# EAGLE design 140508_AriloTX_REV2_0_0 (EAGLE 6.4)
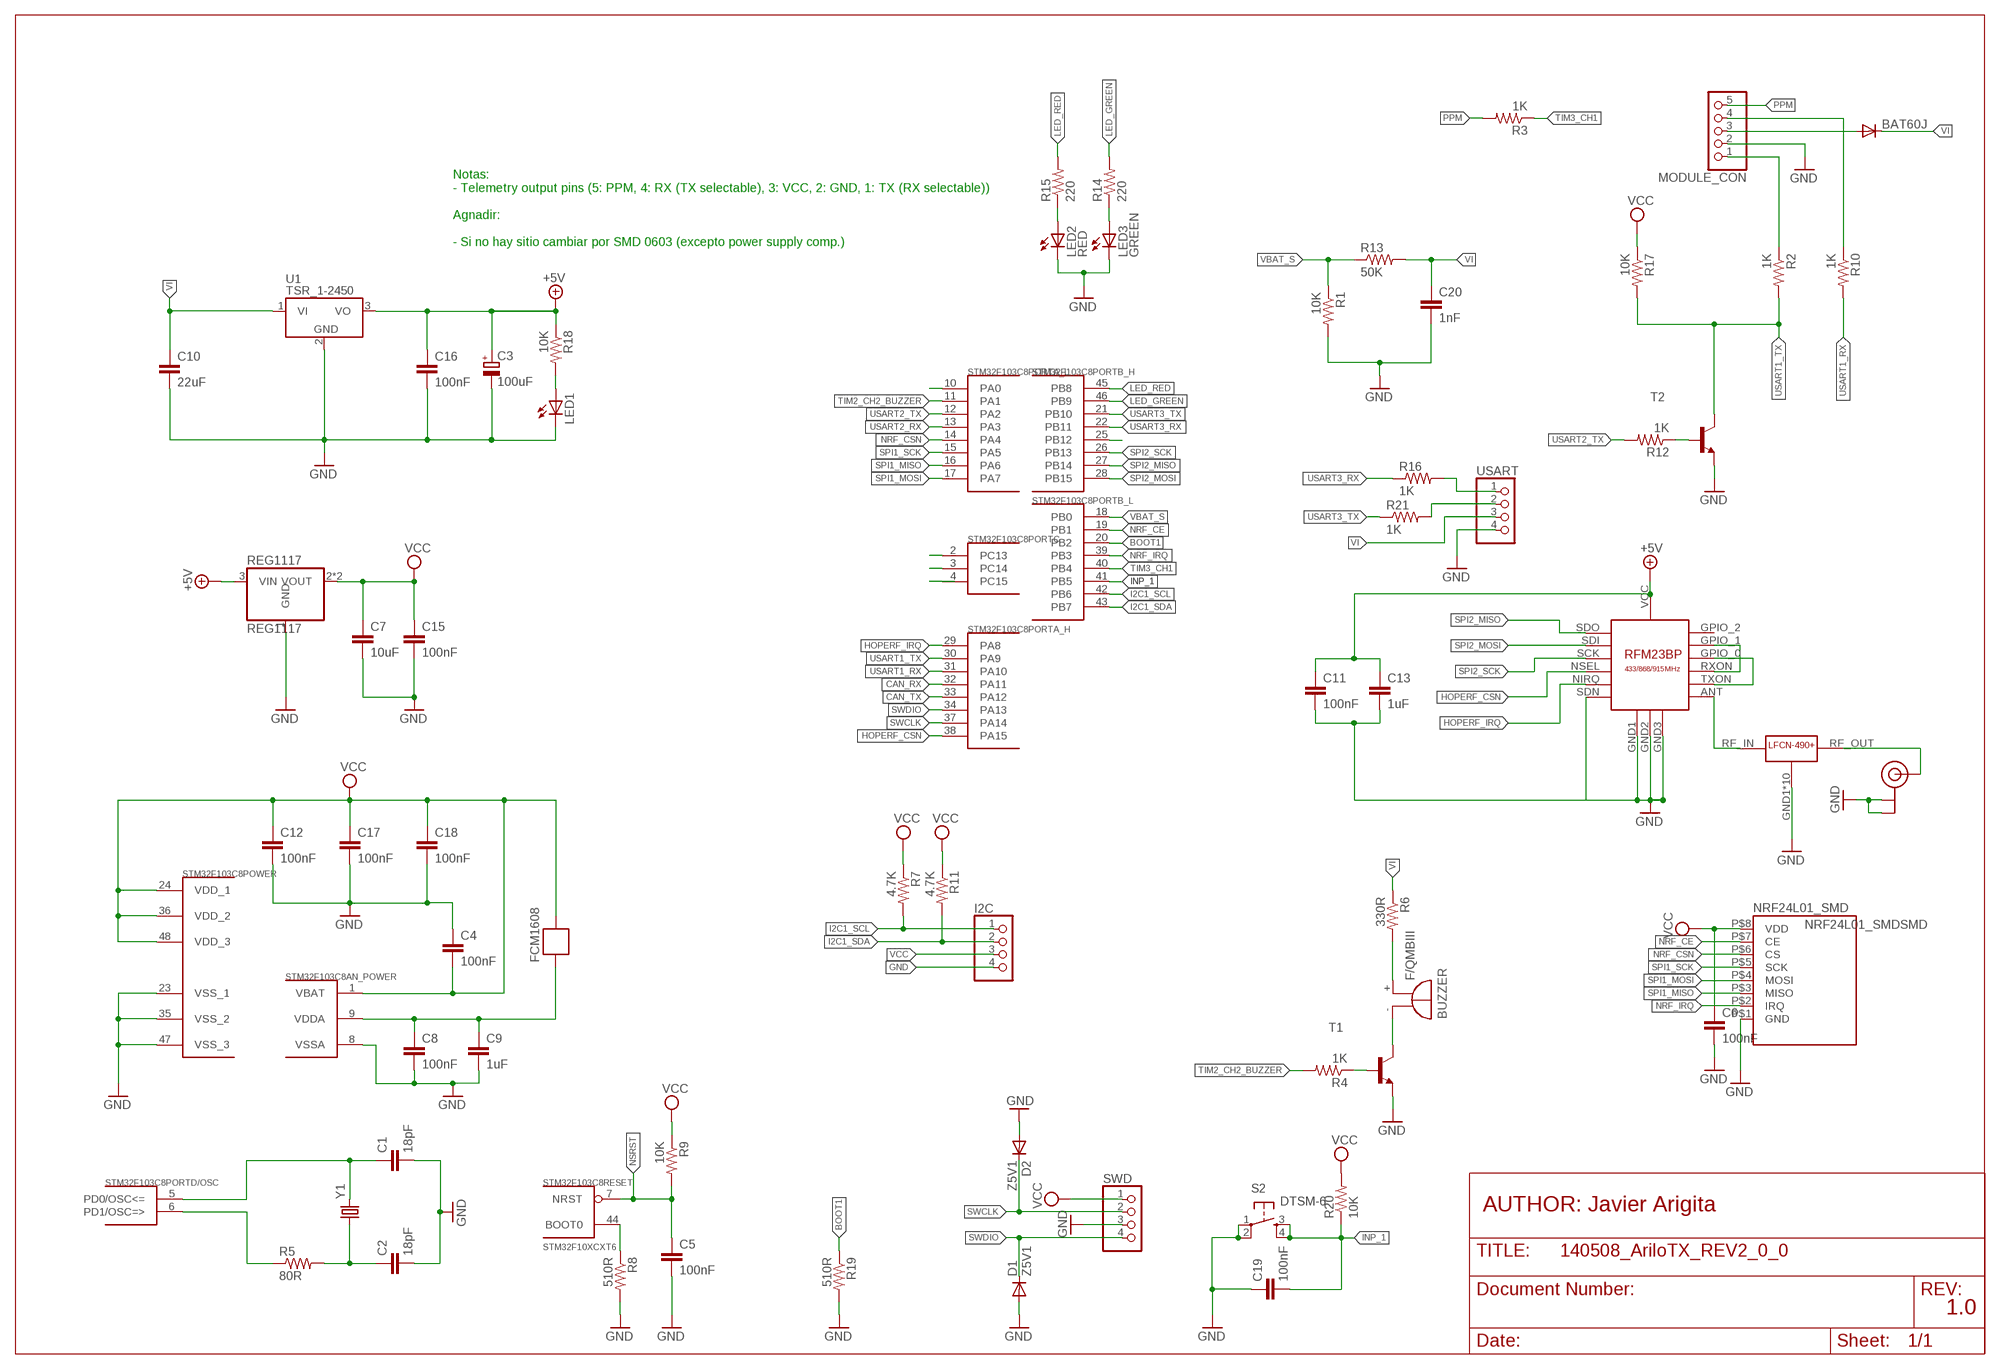
[diagram p0: schematic, sheet 1]

## Parts
BAT60J  DIODE-SOD323-R  [SOD323-R]
BUZZER  F/QMBIII  [F/QMBIII]
C1  18pF  C-EUC0805  [C0805]
C2  18pF  C-EUC0805  [C0805]
C3  100uF  CPOL-EUSMCB  [SMC_B]
C4  100nF  C-EUC0805  [C0805]
C5  100nF  C-EUC0805  [C0805]
C6  100nF  C-EUC0805  [C0805]
C7  10uF  C-EUC0805  [C0805]
C8  100nF  C-EUC0805  [C0805]
C9  1uF  C-EUC3216  [C3216]
C10  22uF  C-EUC3216  [C3216]
C11  100nF  C-EUC0805  [C0805]
C12  100nF  C-EUC0805  [C0805]
C13  1uF  C-EUC3216  [C3216]
C15  100nF  C-EUC0805  [C0805]
C16  100nF  C-EUC0805  [C0805]
C17  100nF  C-EUC0805  [C0805]
C18  100nF  C-EUC0805  [C0805]
C19  100nF  C-EUC0805  [C0805]
C20  1nF  C-EUC0805  [C0805]
D1  Z5V1  DIODE-SOD323-R  [SOD323-R]
D2  Z5V1  DIODE-SOD323-R  [SOD323-R]
FCM1608  FERRITE-BEAD  [R0603]
I2C  PINHD-1X4  [1X04]
LED1  LED0805  [CHIPLED_0805]
LED2  RED  LEDCHIP-LED0805  [CHIP-LED0805]
LED3  GREEN  LEDCHIP-LED0805  [CHIP-LED0805]
MODULE_CON  PINHD-1X5  [1X05]
NRF24L01_SMD  NRF24L01_SMDSMD  [NRF24L01_SMD]
R1  10K  RESISTOR0805  [R0805]
R2  1K  RESISTOR0805  [R0805]
R3  1K  RESISTOR0805  [R0805]
R4  1K  RESISTOR0805  [R0805]
R5  80R  RESISTOR0805  [R0805]
R6  330R  RESISTOR0805  [R0805]
R7  4.7K  RESISTOR0805  [R0805]
R8  510R  RESISTOR0805  [R0805]
R9  10K  RESISTOR0805  [R0805]
R10  1K  RESISTOR0805  [R0805]
R11  4.7K  RESISTOR0805  [R0805]
R12  1K  RESISTOR0805  [R0805]
R13  50K  RESISTOR0805  [R0805]
R14  220  RESISTOR0805  [R0805]
R15  220  RESISTOR0805  [R0805]
R16  1K  RESISTOR0805  [R0805]
R17  10K  RESISTOR0805  [R0805]
R18  10K  RESISTOR0805  [R0805]
R19  510R  RESISTOR0805  [R0805]
R20  10K  RESISTOR0805  [R0805]
R21  1K  RESISTOR0805  [R0805]
REG1117  REG1117  [SOT223]
S2  DTSM-6  [DTSM-6]
STM32F103C8  STM32F10XCXT6  [TQFP48]
SWD  PINHD-1X4  [1X04]
T1  BC848-NPN-SOT23-BEC  [SOT23-BEC]
T2  BC848-NPN-SOT23-BEC  [SOT23-BEC]
U1  TSR_1-2450  [TSR-1]
U$1  RFM23BP  [RFM23BP]
U$2  LFCN490+  [LFCN490+]
U$3  U.FL  [U.FL]
USART  PINHD-1X4  [1X04]
Y1  CRYSTAL5X3  [CRYSTAL-SMD-5X3]

## Nets
+5V: C3.+ C11.1 C13.1 C16.1 R18.1 REG1117.3(VIN) U1.3(VO) U$1.VCC
BOOT1: R19.1 STM32F103C8.20(PORTB_L:PB2)
CAN_RX: STM32F103C8.32(PORTA_H:PA11)
CAN_TX: STM32F103C8.33(PORTA_H:PA12)
GND: C1.2 C2.2 C3.- C4.1 C5.2 C6.2 C7.2 C8.2 C9.2 C10.2 C11.2 C12.2 C13.2 C15.2 C16.2 C17.2 C18.2 C19.1 C20.2 D1.A D2.A I2C.4 LED1.C LED2.C LED3.C MODULE_CON.2 NRF24L01_SMD.P$1(GND) R1.2 R8.2 R19.2 REG1117.1(GND) S2.1 S2.2 STM32F103C8.8(AN_POWER:VSSA) STM32F103C8.23(POWER:VSS_1) STM32F103C8.35(POWER:VSS_2) STM32F103C8.47(POWER:VSS_3) SWD.3 T1.E T2.E U1.2(GND) U$1.GND1 U$1.GND2 U$1.GND3 U$1.SDN U$2.GND1(GND) U$2.GND2(GND) U$2.GND3(GND) U$2.GND4(GND) U$2.GND5(GND) U$2.GND6(GND) U$2.GND7(GND) U$2.GND8(GND) U$2.GND9(GND) U$2.GND10(GND) U$3.P$1(GND) U$3.P$2(GND) USART.4
HOPERF_CSN: STM32F103C8.38(PORTA_H:PA15) U$1.NSEL
HOPERF_IRQ: STM32F103C8.29(PORTA_H:PA8) U$1.NIRQ
I2C1_SCL: I2C.1 R7.2 STM32F103C8.42(PORTB_L:PB6)
I2C1_SDA: I2C.2 R11.2 STM32F103C8.43(PORTB_L:PB7)
INP_1: C19.2 R20.1 S2.3 S2.4 STM32F103C8.41(PORTB_L:PB5)
LED_GREEN: R14.2 STM32F103C8.46(PORTB_H:PB9)
LED_RED: R15.2 STM32F103C8.45(PORTB_H:PB8)
N$1: C1.1 STM32F103C8.5(PORTD/OSC:PD0/OSC<=) Y1.3
N$2: R5.1 STM32F103C8.6(PORTD/OSC:PD1/OSC=>)
N$3: C2.1 R5.2 Y1.1
N$4: R8.1 STM32F103C8.44(RESET:BOOT0)
N$5: R12.1 T2.B
N$6: MODULE_CON.1 R2.1
N$7: LED2.A R15.1
N$8: LED3.A R14.1
N$9: MODULE_CON.4 R10.1
N$10: LED1.A R18.2
N$11: U$1.ANT U$2.RF_IN(RF_INP)
N$12: R16.2 USART.1
N$13: R21.2 USART.2
N$14: BAT60J.A MODULE_CON.3
N$15: STM32F103C8.2(PORTC:PC13)
N$16: BUZZER.+(-) R6.2
N$17: C8.1 C9.1 FCM1608.2 STM32F103C8.9(AN_POWER:VDDA)
N$18: STM32F103C8.3(PORTC:PC14)
N$20: U$2.RF_OUT(RF_OUTP) U$3.P$3(SIGNAL)
N$21: R4.1 T1.B
N$22: STM32F103C8.25(PORTB_H:PB12)
N$23: BUZZER.-(+) T1.C
N$24: STM32F103C8.10(PORTA_L:PA0)
N$25: U$1.GPIO_1 U$1.RXON
N$26: U$1.GPIO_0 U$1.TXON
NRF_CE: NRF24L01_SMD.P$7(CE) STM32F103C8.19(PORTB_L:PB1)
NRF_CSN: NRF24L01_SMD.P$6(CS) STM32F103C8.14(PORTA_L:PA4)
NRF_IRQ: NRF24L01_SMD.P$2(IRQ) STM32F103C8.39(PORTB_L:PB3)
NSRST: C5.1 R9.2 STM32F103C8.7(RESET:NRST)
PPM: MODULE_CON.5 R3.2
SPI1_MISO: NRF24L01_SMD.P$3(MISO) STM32F103C8.16(PORTA_L:PA6)
SPI1_MOSI: NRF24L01_SMD.P$4(MOSI) STM32F103C8.17(PORTA_L:PA7)
SPI1_SCK: NRF24L01_SMD.P$5(SCK) STM32F103C8.15(PORTA_L:PA5)
SPI2_MISO: STM32F103C8.27(PORTB_H:PB14) U$1.SDO
SPI2_MOSI: STM32F103C8.28(PORTB_H:PB15) U$1.SDI
SPI2_SCK: STM32F103C8.26(PORTB_H:PB13) U$1.SCK
SWCLK: D2.C STM32F103C8.37(PORTA_H:PA14) SWD.2
SWDIO: D1.C STM32F103C8.34(PORTA_H:PA13) SWD.4
TIM2_CH2_BUZZER: R4.2 STM32F103C8.11(PORTA_L:PA1)
TIM3_CH1: R3.1 STM32F103C8.40(PORTB_L:PB4)
USART1_RX: R10.2 STM32F103C8.31(PORTA_H:PA10)
USART1_TX: R2.2 R17.2 STM32F103C8.30(PORTA_H:PA9) T2.C
USART2_RX: STM32F103C8.13(PORTA_L:PA3)
USART2_TX: R12.2 STM32F103C8.12(PORTA_L:PA2)
USART3_RX: R16.1 STM32F103C8.22(PORTB_H:PB11)
USART3_TX: R21.1 STM32F103C8.21(PORTB_H:PB10)
VBAT_S: R1.1 R13.1 STM32F103C8.18(PORTB_L:PB0)
VCC: C4.2 C6.1 C7.1 C12.1 C15.1 C17.1 C18.1 FCM1608.1 I2C.3 NRF24L01_SMD.P$8(VDD) R7.1 R9.1 R11.1 R17.1 R20.2 REG1117.2(VOUT) REG1117.4(VOUT) STM32F103C8.1(AN_POWER:VBAT) STM32F103C8.24(POWER:VDD_1) STM32F103C8.36(POWER:VDD_2) STM32F103C8.48(POWER:VDD_3) SWD.1
VI: BAT60J.C C10.1 C20.1 R6.1 R13.2 U1.1(VI) USART.3
Unconnected: STM32F103C8.4(PORTC:PC15) U$1.GPIO_2

## Notes on the sheet
- Notas:
  - Telemetry output pins (5: PPM, 4: RX (TX selectable), 3: VCC, 2: GND, 1: TX (RX selectable))
  
  Agnadir:
  
  - Si no hay sitio cambiar por SMD 0603 (excepto power supply comp.)
- AUTHOR: Javier Arigita
- 1.0

## Library data of the parts
BAT60J D1 D2 = diode:DIODE-: DIODE
BUZZER = buzzer:F/QMBIII: BUZZER Source: Buerklin; OC_FARNELL: unknown; OC_NEWARK: unknown
C1 C2 C4-C8 C11 C12 C15-C20 = rcl:C-EU: CAPACITOR, European symbol
C3 = rcl:CPOL-EU: POLARIZED CAPACITOR, European symbol
C9 C10 C13 = resistor:C-EU: CAPACITOR, European symbol
FCM1608 = BaseApp:FERRITE-BEAD
I2C SWD USART = pinhead:PINHD-1X4: PIN HEADER
LED1 = CEDT:LED
LED2 LED3 = led:LED: LED OSRAM: - CHIPLED LG R971, LG N971, LY N971, LG Q971, LY Q971, LO R971, LY R971 LH N974, LH R974 LS Q976, LO Q976, LY Q976 LO Q996 - Hyper CHIPLED LW Q18S LB Q993, LB Q99A, LB R99A - SideLED LS A670, LO A670, LY A670, LG A670, LP A670 LB A673, LV A673, LT A673, LW A673 LH A674 LY A675 LS A676, LA A676, LO A676, LY A676, LW A676 LS A679, LY A679, LG A679 - Hyper Micro SIDELED® LS Y876, LA Y876, LO Y876, LY Y876 LT Y87S - SmartLED LW L88C, LW L88S LB L89C, LB L89S, LG L890 LS L89K, LO L89K, LY L89K LS L896, LA L896, LO L896, LY L896 - TOPLED LS T670, LO T670, LY T670, LG T670, LP T670 LSG T670, LSP T670, LSY T670, LOP T670, LYG T670 LG T671, LOG T671, LSG T671 LB T673, LV T673, LT T673, LW T673 LH T674 LS T676, LA T676, LO T676, LY T676, LB T676, LH T676, LSB T676, LW T676 LB T67C, LV T67C, LT T67C, LS T67K, LO T67K, LY T67K, LW E67C LS E67B, LA E67B, LO E67B, LY E67B, LB E67C, LV E67C, LT E67C LW T67C LS T679, LY T679, LG T679 LS T770, LO T770, LY T770, LG T770, LP T770 LB T773, LV T773, LT T773, LW T773 LH T774 LS E675, LA E675, LY E675, LS T675 LS T776, LA T776, LO T776, LY T776, LB T776 LHGB T686 LT T68C, LB T68C - Hyper Mini TOPLED® LB M676 - Mini TOPLED Santana® LG M470 LS M47K, LO M47K, LY M47K Source: http://www.osram.convergy.de LUXEON: - LUMILED® LXK2-PW12-R00, LXK2-PW12-S00, LXK2-PW14-U00, LXK2-PW14-V00 LXK2-PM12-R00, LXK2-PM12-S00, LXK2-PM14-U00 LXK2-PE12-Q00, LXK2-PE12-R00, LXK2-PE12-S00, LXK2-PE14-T00, LXK2-PE14-U00 LXK2-PB12-K00, LXK2-PB12-L00, LXK2-PB12-M00, LXK2-PB14-N00, LXK2-PB14-P00, LXK2-PB14-Q00 LXK2-PR12-L00, LXK2-PR12-M00, LXK2-PR14-Q00, LXK2-PR14-R00 LXK2-PD12-Q00, LXK2-PD12-R00, LXK2-PD12-S00 LXK2-PH12-R00, LXK2-PH12-S00 LXK2-PL12-P00, LXK2-PL12-Q00, LXK2-PL12-R00 Source: www.luxeon.com KINGBRIGHT: KA-3528ASYC Source: www.kingbright.com
MODULE_CON = pinhead:PINHD-1X5: PIN HEADER
NRF24L01_SMD = NRF24L01+:NRF24L01_SMD
R1-R21 = CEDT:RESISTOR
REG1117 = CEDT:REG1117: 800mA and 1A Low Dropout (LDO) Positive Regulator 1.8V, 2.5V, 2.85V, 3.3V, 5V, and Adj
S2 = switch-tact:DTSM-6
STM32F103C8 = stm32:STM32F10XCXT6: ST STM32F101/103 48pin LQFP
T1 T2 = transistor:*-NPN-: NPN Transistror BF959 corrected 2008.03.06
U1 = _hhn_traco_tsr-1:TSR_1-*: TRACO TSR-1 Series Point-of-Load DC/DC-Converters Vi max. 36 V; Vo = (1.2 .. 15)V ±2%; Io = 0 .. 1 A SIP-Package (drop-in replacement for 78xx linear voltage regulators in TO220-package, vertically assembled) Source: www.tracopower.com Technologies: TSR 1- Vi (V) Vo (V) ±2% Io = 0 .. 1 A 24_ ( generic ) 2412 4.6 .. 36 1.2 2415 4.6 .. 36 1.5 2418 4.6 .. 36 1.8 2425 4.6 .. 36 2.5 2433 4.75.. 36 3.3 2450 6.5 .. 36 5.0 2465 9.0 .. 36 6.5 2490 12 .. 36 9.0 24120 15 .. 36 12 24150 18 .. 36 15 Author: Dipl.-Ing. FH Rainer Bayer HHN Hochschule Heilbronn, rainer.bayer@hs-heilbronn.de Ingenieurbüro ing-rb, mail@ing-rb.de
U$1 = RFM23BP:RFM23BP: HopeRF RFM23BP Library by: http://projects.weber-itam.de
U$2 = RFM23BP:LFCN490+
U$3 = SparkFun-Connectors:U.FL: SMD antenna connector- WRL-09144
Y1 = SparkFun-FreqCtrl:CRYSTAL: Various standard crystals. Proven footprints. Spark Fun Electronics SKU : COM-00534

## Board
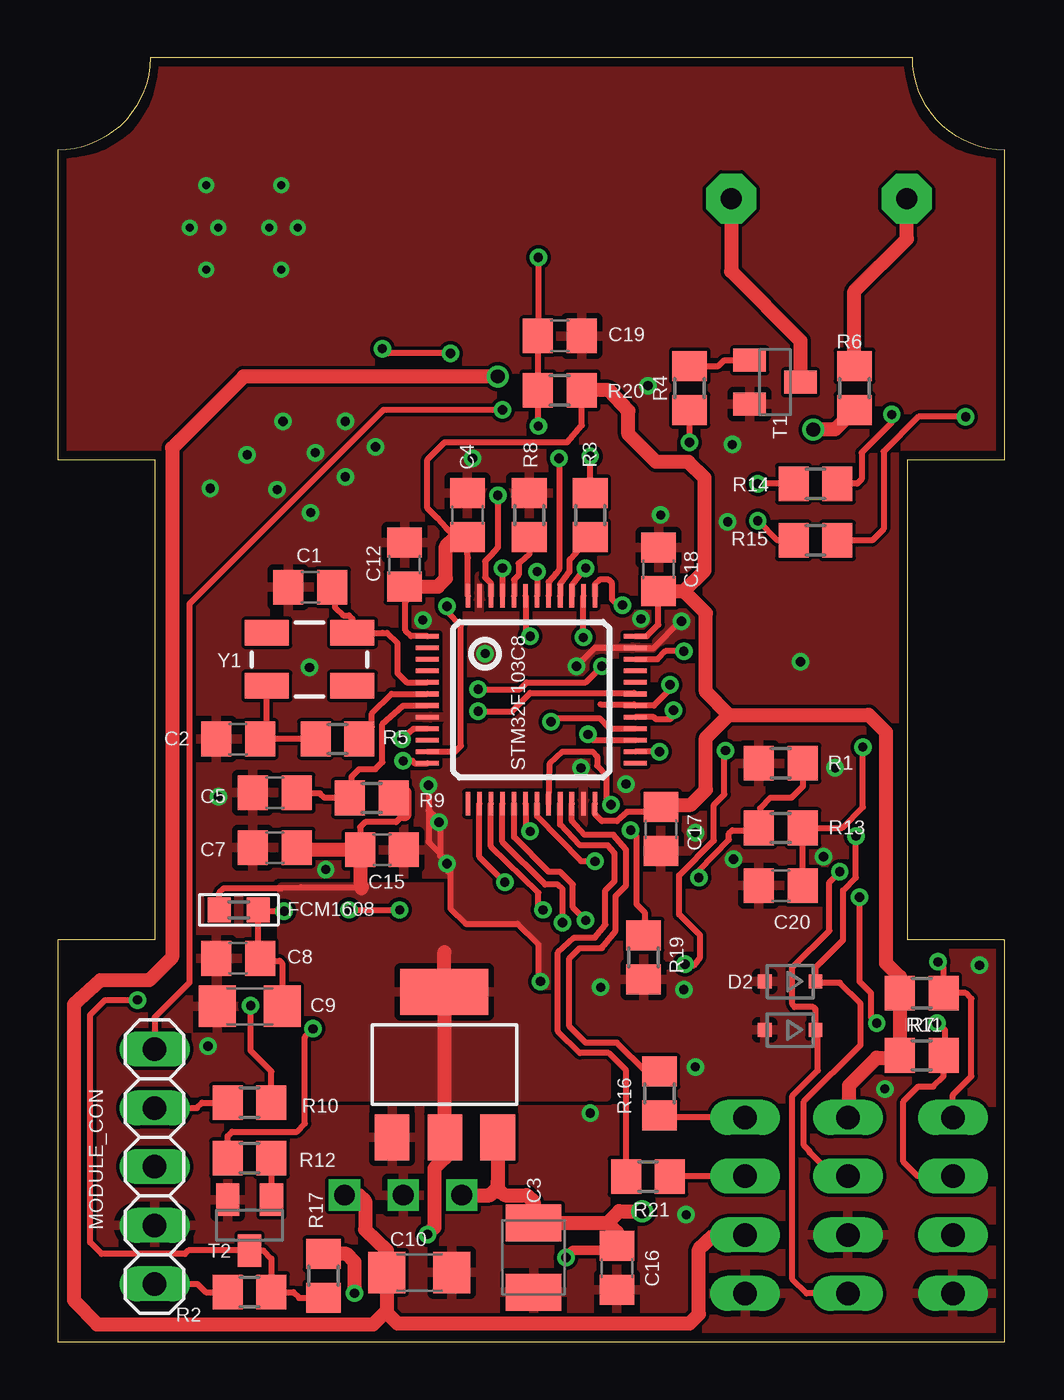
[diagram p1: board, top side]
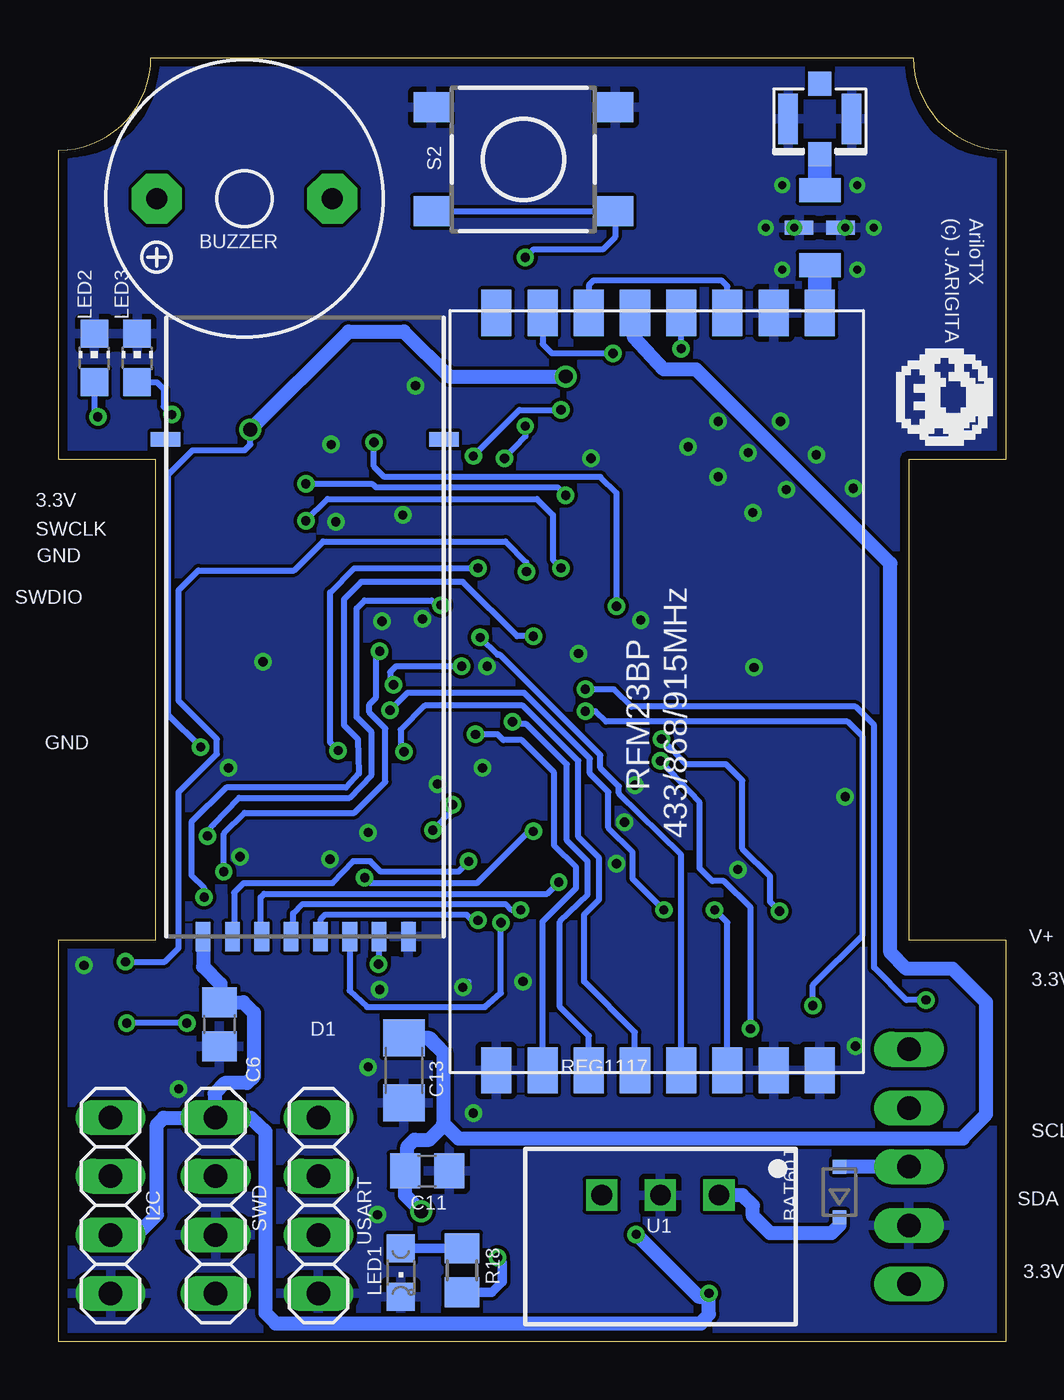
[diagram p2: board, bottom side, seen from below]

Size 41 x 55.6 mm. Coordinates in mm from the lower left corner, seen from the top.
Outline: 0,0 41,0 41,17.4 36.8,17.4 36.8,38.2 41,38.2 41,51.6 arc-90 37,55.6 4,55.6 arc-90 0,51.6 0,38.2 4.2,38.2 4.2,17.4 0,17.4 0,0
Copper layers (1*16): Top 0.0356mm / dielectric 1.5011mm / Bottom 0.0356mm
Design rules "LaenPCBOrder": minimum track width 6mil, minimum drill 13mil, track to track 6mil, track to pad 6mil, pad to pad 6mil, via to via 6mil, smd to smd 6mil, copper to edge 15mil, drill to drill 6mil, minimum pad ring 7mil, minimum via ring 7mil, stop-mask expansion 4mil, vias tented up to drill 0mil, thermal gap 10mil

### Footprints (pad centres in the part's own frame; a part is rotated, then mirrored left to right if it is on the bottom)
SOD323-R = smd 0.6 x 0.6: A 1.1,0; C -1.1,0
F/QMBIII = drill 0.914 pad 2.159 octagon: + 3.8,0; - -3.8,0
C0805 = smd 1.3 x 1.5: 1 -0.95,0; 2 0.95,0
SMC_B = smd 1.6 x 2.4: + -1.5,0; - 1.5,0
C3216 = smd 1.6 x 1.8: 1 -1.4,0; 2 1.4,0
R0603 = smd 1 x 1.1: 1 -0.85,0; 2 0.85,0
1X04 = drill 1.016 long: 1 -3.81,0; 2 -1.27,0; 3 1.27,0; 4 3.81,0
CHIPLED_0805 = smd 1.2 x 1.2: A 0,-1.05; C 0,1.05
CHIP-LED0805 = smd 1.2 x 1.2: A 0,-1.05; C 0,1.05
1X05 = drill 1.016 long: 1 -5.08,0; 2 -2.54,0; 3 0,0; 4 2.54,0; 5 5.08,0
NRF24L01_SMD = smd 1.27 x 0.635: P$1 26.807,10.492; P$2 26.807,9.222; P$3 26.807,7.952; P$4 26.807,6.682; P$5 26.807,5.412; P$6 26.807,4.142; P$7 26.807,2.872; P$8 26.807,1.602 | smd 0.635 x 1.27: P$11 5.267,-0.018; P$13 5.267,12.032
R0805 = smd 1.3 x 1.5: 1 -0.95,0; 2 0.95,0
SOT223 = smd 1.499 x 2.007: 1 -2.261,-3.15; 2 0.025,-3.15; 3 2.311,-3.15 | smd 3.81 x 2.007: 4 0,3.15
DTSM-6 = smd 1.55 x 1.3: 1 -3.975,2.25; 2 3.975,2.25; 3 -3.975,-2.25; 4 3.975,-2.25
TQFP48 = smd 0.2 x 1: 1 -2.75,-4.5; 2 -2.25,-4.5; 3 -1.75,-4.5; 4 -1.25,-4.5; 5 -0.75,-4.5; 6 -0.25,-4.5; 7 0.25,-4.5; 8 0.75,-4.5; 9 1.25,-4.5; 10 1.75,-4.5; 11 2.25,-4.5; 12 2.75,-4.5; 25 2.75,4.5; 26 2.25,4.5; 27 1.75,4.5; 28 1.25,4.5; 29 0.75,4.5; 30 0.25,4.5; 31 -0.25,4.5; 32 -0.75,4.5; 33 -1.25,4.5; 34 -1.75,4.5; 35 -2.25,4.5; 36 -2.75,4.5 | smd 1 x 0.2: 13 4.5,-2.75; 14 4.5,-2.25; 15 4.5,-1.75; 16 4.5,-1.25; 17 4.5,-0.75; 18 4.5,-0.25; 19 4.5,0.25; 20 4.5,0.75; 21 4.5,1.25; 22 4.5,1.75; 23 4.5,2.25; 24 4.5,2.75; 37 -4.5,2.75; 38 -4.5,2.25; 39 -4.5,1.75; 40 -4.5,1.25; 41 -4.5,0.75; 42 -4.5,0.25; 43 -4.5,-0.25; 44 -4.5,-0.75; 45 -4.5,-1.25; 46 -4.5,-1.75; 47 -4.5,-2.25; 48 -4.5,-2.75
SOT23-BEC = smd 1 x 1.4: B -0.95,-1.1; C 0,1.1; E 0.95,-1.1
TSR-1 = drill 0.9 square: 1 -2.54,0; 2 0,0; 3 2.54,0
RFM23BP = smd 2 x 1.3: ANT 16.9,-7.5; GND1 -15.9,6.5; GND2 -15.9,-7.5; GND3 16.9,-5.5; GPIO_0 16.9,2.5; GPIO_1 16.9,4.5; GPIO_2 16.9,6.5; NIRQ -15.9,-3.5; NSEL -15.9,-1.5; RXON 16.9,-1.5; SCK -15.9,0.5; SDI -15.9,2.5; SDN -15.9,-5.5; SDO -15.9,4.5; TXON 16.9,-3.5; VCC 16.9,0.5
LFCN490+ = drill 0.34 pad 0.61: GND1 0.326,2.526; GND2 2.145,3.237; GND3 3.984,2.526; GND4 2.145,2.005; GND7 2.145,-0.205; GND8 0.316,-0.726; GND9 2.145,-1.437; GND10 3.984,-0.726 | smd 0.61 x 1.245: GND5 2.145,1.8; GND6 2.145,0 | smd 1.04 x 1.8: RF_IN 0.52,0.9; RF_OUT 3.77,0.9
U.FL = smd 2.2 x 0.85: P$1 0,1.375; P$2 0,-1.375 | smd 1.05 x 1: P$3 1.525,0; P$4 -1.525,0
CRYSTAL-SMD-5X3 = smd 1.9 x 1.1: 1 -1.85,-1.15; 2 1.85,-1.15; 3 1.85,1.15; 4 -1.85,1.15

### Placement (x,y rotation side)
BAT60J  7.2,6.48 90 bottom
BUZZER  32.95,49.5 180 bottom
C1  10.94,32.67 180 top
C2  7.81,26.1 180 top
C3  20.6,3.65 270 top
C4  17.73,35.8 270 top
C5  9.4,23.77 180 top
C6  34.03,13.75 270 bottom
C7  9.4,21.4 180 top
C8  7.81,16.6 180 top
C9  8.31,14.53 180 top
C10  15.65,3 0 top
C11  25.05,7.4 0 bottom
C12  15.01,33.65 90 top
C13  26.05,11.75 270 bottom
C15  14.04,21.3 0 top
C16  24.2,3.2 270 top
C17  26.11,22.2 270 top
C18  26.01,33.45 90 top
C19  21.73,43.55 180 top
C20  31.3,19.75 180 top
D1  31.7,13.5 180 top
D2  31.7,15.6 180 top
FCM1608  7.83,18.7 0 top
I2C  38.75,5.9 270 bottom
LED1  26.18,3 180 bottom
LED2  39.45,42.6 0 bottom
LED3  37.6,42.6 0 bottom
MODULE_CON  4.19,7.58 90 top
NRF24L01_SMD  36.35,44.35 270 bottom
R1  31.3,25.05 180 top
R2  8.3,2.15 0 top
R3  23.05,35.8 90 top
R4  27.35,41.3 270 top
R5  12.11,26.1 180 top
R6  34.48,41.3 90 top
R7  37.4,15.1 0 top
R8  20.41,35.8 90 top
R9  13.59,23.55 180 top
R10  8.3,10.35 0 top
R11  37.4,12.4 0 top
R12  8.3,7.95 180 top
R13  31.3,22.25 0 top
R14  32.8,37.15 180 top
R15  32.8,34.7 180 top
R16  26.05,10.75 270 top
R17  11.5,2.85 270 top
R18  23.54,3.1 90 bottom
R19  25.36,16.65 270 top
R20  21.73,41.2 0 top
R21  25.55,7.15 0 top
REG1117  16.73,12 0 top
S2  20.89,51.2 0 bottom
STM32F103C8  20.5,27.8 270 top
SWD  34.2,5.9 270 bottom
T1  31.05,41.55 270 top
T2  8.3,5.05 180 top
U1  14.95,6.35 180 bottom
U$1  15.55,27.65 90 bottom
U$2  7.15,46.1 90 bottom
U$3  8.05,52.95 270 bottom
USART  29.75,5.9 270 bottom
Y1  10.9,29.55 0 top

### Tracks (layer width: path | path; a pad name or v marks a point on that pad's centre or on a via)
+5V  (via drill 0.4, 0.6)
  Top 0.406: v22,3.65 22.3,3.95 24,3.95 C16.1
  Top 0.61: U1.3 18.7,6.35 | 18.7,6.35 19.05,6.6 19.35,6.35 20.3,6.35 20.6,6.05 C3.+ 23.8,5.15 | 23.8,5.15 24.2,4.75 C16.1 | REG1117.3 19.05,6.7 19.05,7 19.05,6.65 18.7,6.35 | 23.8,5.15 24.3,5.65 v25.3,5.65
  Bottom 0.406: R18.1 22.25,2.15 21.8,2.6 21.8,3.45 v22,3.65
  Bottom 0.61: v25.3,5.65 26,6.35 C11.1 25.9,7.5 25.9,8.45 25.6,8.75 24.95,8.75 24.35,9.35 24.35,9.45 | 24.35,12.5 24.95,13.15 | 25.85,13.1 25.9,13.15 C13.1 24.95,13.15 | 24.95,13.15 24.95,13.1 24.35,12.5 | 24.35,12.5 24.35,9.45 | 24.35,9.45 23.7,8.8 1.85,8.8 1.85,8.85 0.85,9.85 0.85,14.7 2.3,16.15 4.3,16.15 5,16.85 5,33.7 13.4,42.1 14.8,42.1 16.1,43.5 16.1,44.5 U$1.VCC
BOOT1  (via drill 0.4)
  Top 0.254: STM32F103C8.20 21.3,25.05 21.85,25.55 23.15,25.55 23.35,25.35 23.35,24.95 23.75,24.55 23.75,23.45 v23.95,23.25 | v24.8,22.15 25.05,21.9 25.05,18.95 25.4,18.6 25.4,17.64 R19.1
  Bottom 0.254: v23.95,23.25 23.95,23 v24.8,22.15
GND  (via drill 0.4)
  Top 0.254: 16.9,20.35 16.9,20.7 16.55,21.05 16.55,22.5 16.05,23 v16.05,24.1 16.05,21.65 17,20.7 17,18.75 17.65,18.1 19.9,18.1 20.8,17.2 20.8,15.7 v20.9,15.6 | 26.95,31.2 25.8,30.05 STM32F103C8.35 23.25,30.05 v22.45,29.25
  Bottom 0.254: 23.25,15.6 v23.5,15.35
  other vias: 11.15,38.5 27.6,22.05 27.1,15.25 6.5,12.8 24.6,24.15 23.05,9.9 27.6,11.9 9.75,39.85 6.6,36.95 8.2,38.4 9.5,36.9 10.95,35.9 12.45,37.45 13.75,38.75 12.45,39.85 18.5,29.8 33.15,21 39.9,16.3 27.2,5.5 35.8,10.95 32.15,29.45 29.2,38.85 25.55,41.4 27,31.2 26.1,35.8 6.95,23.6 17.95,38.25 29,35.5 15.8,31.25 29.25,20.9 33.65,24.85 22.65,24.85 16.5,22.5 10.9,29.2 16.85,20.7 11.6,20.45 25.25,31.3
  pour Top (rank 2): 40.5,16.9 36.3,17 36.3,38.7 40.5,38.7 40.5,42.5 40.5,44.5 40.5,51.1 arc-90 36.5,55.1 33.5,55.1 31.5,55.1 9.5,55.1 7.5,55.1 4.5,55.1 arc-90 0.5,51.1 0.5,38.7 4.7,38.7 4.7,16.9 0.5,16.9 0.5,0.5 40.5,0.5
  pour Bottom (rank 2): 40.5,16.9 36.3,17 36.3,38.7 40.5,38.7 40.5,51.1 arc-90 36.5,55.1 4.5,55.1 arc-90 0.5,51.1 0.5,38.7 4.7,38.7 4.7,16.9 0.5,16.9 0.5,0.5 40.5,0.5
HOPERF_CSN  (via drill 0.4)
  Top 0.254: v22.75,30.5 STM32F103C8.38
  Bottom 0.254: U$1.NSEL 14.05,21.1 16.75,23.75 16.75,24.05 17.55,24.85 17.55,25.4 21.9,29.75 22,29.75 v22.75,30.5
HOPERF_IRQ  (via drill 0.4)
  Top 0.254: v12.6,18.7 v14.8,18.7 | v26.65,27.35 26.65,27.1 26.5,26.95 25.9,26.95 25.8,27.05 STM32F103C8.29
  Bottom 0.254: U$1.NIRQ 12.05,18.15 v12.6,18.7 | v14.8,18.7 16.15,20.05 16.15,21.2 17.2,22.25 17.2,23.8 18,24.6 18,25.25 20.85,28.1 25.9,28.1 v26.65,27.35
I2C1_SCL  (via drill 0.4)
  Top 0.254: I2C.1 38.75,10.7 39.55,11.5 39.55,14.85 39.3,15.1 R7.2 38.35,16.2 v38.1,16.45 | v20.75,33.35 STM32F103C8.42
  Bottom 0.254: v38.1,16.45 36.4,16.45 35.8,17.05 35.8,23.8 34.15,25.45 34.15,26.1 35.8,27.75 35.8,32.55 34.95,33.4 30.8,33.4 29.55,34.65 21.65,34.65 20.75,33.75 v20.75,33.35
I2C1_SDA  (via drill 0.4)
  Top 0.254: I2C.2 37.23,7.17 36.6,7.8 36.6,10.4 37.25,11.05 37.9,11.05 38.35,11.5 R11.2 38.4,12.45 38.4,13.5 38.1,13.8 v38.05,13.8 | STM32F103C8.43 20.25,30.75 v20.45,30.55 | v34.7,19.25 34.7,15.6 35.2,15.1 35.2,14.05 v35.45,13.8
  Bottom 0.254: v20.45,30.55 21.15,30.55 23.5,32.9 27.9,32.9 28.65,32.15 28.65,26.7 28.05,26.1 28,24.6 28.55,24 33.75,24 35.25,22.5 35.25,20.2 34.7,19.65 v34.7,19.25 | v35.45,13.8 v38.05,13.8
INP_1  (via drill 0.4)
  Top 0.254: v20.8,46.95 20.8,43.56 C19.2 R20.1 20.79,39.72 v20.8,39.65 | v21.7,38.25 21.7,33.45 21.55,33.25 21.25,32.9 STM32F103C8.41
  Bottom 0.254: S2.3 S2.4 16.91,47.84 17.45,47.3 20.45,47.3 v20.8,46.95 | v20.8,39.65 20.8,39.2 v21.7,38.25
LED_GREEN  (via drill 0.4)
  Top 0.254: R14.2 v30.3,37.15 | v19.05,36.65 19.05,34.4 18.75,34.05 18.5,33.8 18.5,33.1 18.75,32.85 STM32F103C8.46
  Bottom 0.254: v30.3,37.15 27.45,37.15 27.25,37 19.4,37 v19.05,36.65
LED_RED  (via drill 0.4)
  Top 0.254: 31.6,34.7 31.15,34.7 v30.3,35.55 | v19.25,33.5 STM32F103C8.45
  Top 0.61: R15.2 31.6,34.7 31.6,34.75
  Bottom 0.254: v30.3,35.55 29.35,36.5 20.3,36.5 19.6,35.8 19.6,33.85 v19.25,33.5
N$1
  Top 0.254: C1.1 12,32.56 12,31.8 12.35,31.45 12.6,31.45 12.75,31.3 Y1.3 14.05,30.7 14.25,30.7 14.7,30.25 14.7,28.95 14.75,28.9 15.1,28.55 STM32F103C8.5
N$2
  Top 0.254: R5.1 13.6,26.64 13.6,27.2 14.45,28.05 STM32F103C8.6
N$3
  Top 0.254: R5.2 C2.1 9.05,26.39 Y1.1
N$4
  Top 0.254: R8.1 20.41,34.11 20,33.75 19.95,33.7 19.95,33.2 19.75,33 STM32F103C8.44
N$5
  Top 0.254: R12.1 T2.B
  Top 0.406: T2.B 9.1,6.3 9.1,6.35
N$6
  Top 0.254: MODULE_CON.1 6.05,2.5 6.4,2.15 R2.1
N$7  (via drill 0.4)
  Top 0.254: v39.3,40.05 37.25,40.05 35.75,38.55 35.75,35.2 35.25,34.7 R15.1
  Bottom 0.254: LED2.A 39.45,40.2 v39.3,40.05
N$8  (via drill 0.4)
  Top 0.254: v36.1,40.15 36.1,39.8 34.8,38.5 34.8,37.35 34.6,37.15 R14.1
  Bottom 0.254: LED3.A 36.75,41.55 36.45,41.25 36.45,40.5 v36.1,40.15
N$9
  Top 0.254: MODULE_CON.4 6.02,10.12 6.25,10.35 R10.1
N$10
  Bottom 0.406: R18.2 LED1.A
N$11
  Bottom 1.016: U$1.ANT U$2.RF_IN
N$12
  Top 0.254: USART.1 26.14,9.71 R16.2
N$13
  Top 0.254: USART.2 26.52,7.17 R21.2
N$14
  Bottom 0.61: MODULE_CON.3 BAT60J.A
N$16
  Top 0.61: R6.2 34.48,45.48 36.75,47.75 BUZZER.+
N$17  (via drill 0.4)
  Top 0.254: C9.1 9.71,16.39 9.6,16.5 8.86,16.5 C8.1 8.69,16.68 FCM1608.2 8.73,18.65 v9.8,18.65 | v14.9,26.1 15.4,26.55 STM32F103C8.9
  Bottom 0.254: v9.8,18.65 10.2,19.05 10.2,20.15 11.4,21.35 11.4,24.3 12.1,25 13.85,25 14.45,25.65 v14.9,26.1
N$20
  Bottom 1.016: U$3.P$3 U$2.RF_OUT
N$21
  Top 0.254: R4.1 28.6,42.25 28.85,42.5 T1.B
N$23
  Top 0.61: BUZZER.- 29.15,46.35 32.15,43.35 T1.C
N$25  (via drill 0.4)
  Top 0.254: v17,42.8 14.3,42.8 v14.05,43
  Bottom 0.254: U$1.GPIO_1 20.05,43.2 19.65,42.8 v17,42.8 | v14.05,43 U$1.RXON
N$26
  Bottom 0.254: U$1.TXON 12.05,45.7 12.3,45.95 17.85,45.95 18.05,45.75 U$1.GPIO_0
NRF_CE  (via drill 0.4)
  Top 0.254: v23.25,20.8 22.65,20.8 20.75,22.75 STM32F103C8.19
  Bottom 0.254: v23.25,20.8 23.7,20.35 27.05,20.35 27.5,20.8 28.25,20.8 29.15,19.85 33,19.85 33.4,19.45 33.4,17.62 NRF24L01_SMD.P$7
NRF_CSN  (via drill 0.4)
  Top 0.254: v19.35,19.9 18.25,21 STM32F103C8.14
  Bottom 0.254: NRF24L01_SMD.P$6 32.25,17.59 32.25,19.25 32.1,19.4 19.85,19.4 v19.35,19.9
NRF_IRQ  (via drill 0.4)
  Top 0.254: v27.15,16.35 27.2,16.3 27.55,16.3 27.8,16.65 27.8,17.6 26.9,18.5 26.9,20.2 28.4,21.7 28.4,23.25 28.85,23.7 28.85,25.55 v28.9,25.6 | v22.85,33.5 22.7,33.35 22.25,32.75 STM32F103C8.39
  Bottom 0.254: NRF24L01_SMD.P$2 27.15,17.52 v27.15,16.35 | v28.9,25.6 29.25,25.95 29.25,32.45 28.2,33.5 v22.85,33.5
NSRST
  Top 0.254: STM32F103C8.7 14.95,27.55 14.05,26.75 14.05,25.1 13.75,24.8 13.05,24.8 12.71,24.46 12.71,23.62 R9.2 11.55,23.55 11.35,23.75 10.38,23.75 C5.1
PPM  (via drill 0.4)
  Top 0.254: R3.2 v23.05,38.35 | v19.25,40.35 14.1,40.35 5.7,31.95 5.7,15.55 4.19,14.04 MODULE_CON.5
  Bottom 0.254: v23.05,38.35 21.05,40.35 v19.25,40.35
SPI1_MISO  (via drill 0.4)
  Top 0.254: v21.85,18.15 21.85,19.6 21.65,19.8 21.1,19.8 19.25,21.65 STM32F103C8.16
  Bottom 0.254: NRF24L01_SMD.P$3 28.4,15.2 27.65,14.5 22.55,14.5 21.85,15.1 v21.85,18.15
SPI1_MOSI  (via drill 0.4)
  Top 0.254: v22.85,18.25 22.3,18.8 22.3,19.8 21.75,20.35 21.25,20.35 19.75,21.85 STM32F103C8.17
  Bottom 0.254: NRF24L01_SMD.P$4 29.65,17.56 29.65,18.3 29.45,18.5 23.35,18.5 23.1,18.25 v22.85,18.25
SPI1_SCK  (via drill 0.4)
  Top 0.254: v21,18.7 20.8,18.9 20.8,19.45 18.75,21.45 STM32F103C8.15
  Bottom 0.254: NRF24L01_SMD.P$5 30.85,17.63 30.85,18.55 30.45,18.95 21.65,18.95 21.4,18.7 v21,18.7
SPI2_MISO  (via drill 0.4)
  Top 0.254: v22.95,26.3 23.2,26.05 STM32F103C8.27
  Bottom 0.254: U$1.SDO 20.05,18.2 18.6,19.65 18.6,20.55 19.55,21.5 19.55,24.65 20.95,26.05 21.75,26.05 22,26.3 v22.95,26.3
SPI2_MOSI  (via drill 0.4)
  Top 0.254: v21.35,26.85 21.5,27 23.45,27 23.9,26.55 STM32F103C8.28
  Bottom 0.254: U$1.SDI 18.05,13.25 19.3,14.5 19.3,18.2 18.1,19.35 18.1,20.8 19,21.7 19,25 20.75,26.75 21.25,26.75 v21.35,26.85
SPI2_SCK  (via drill 0.4)
  Top 0.254: v26.05,25.55 STM32F103C8.26
  Bottom 0.254: U$1.SCK 16.05,13.4 18.25,15.6 18.25,18.5 17.6,19.15 17.6,20.95 18.5,21.85 18.5,25.15 20.9,27.55 25.15,27.55 26.2,26.5 26.2,25.7 v26.05,25.55
SWCLK  (via drill 0.4)
  Top 0.254: SWD.2 33.58,7.17 32.55,8.2 32.55,8.25 32.3,8.5 32.3,10.4 34.75,12.85 34.75,14.65 33.85,15.55 32.85,15.55 D2.C 32.8,16.2 34,17.4 34,19.55 34.55,20.1 v34.55,21.9 | v24.45,31.9 24.25,31.9 24,32.15 24,32.85 23.85,33 23.45,33 23.25,32.8 STM32F103C8.37
  Bottom 0.254: v34.55,21.9 34.55,22.15 34.3,22.4 33.2,23.55 28.4,23.55 27.45,24.55 27.45,26.4 28.1,27.05 28.1,31.75 27.75,32.1 24.85,32.1 24.65,31.9 v24.45,31.9
SWDIO  (via drill 0.4)
  Top 0.254: SWD.4 32.41,2.09 31.8,2.7 31.8,10.65 32.9,11.75 32.9,13.4 D1.C 32.8,14.4 32.7,14.5 31.9,14.5 31.8,14.6 31.8,16.2 33.4,17.8 33.4,19.9 v33.85,20.35 | v27.1,29.9 26.3,29.9 25.95,29.55 STM32F103C8.34
  Bottom 0.254: v33.85,20.35 33.85,22 32.95,22.9 28.2,22.9 26.85,24.25 26.85,26.55 27.55,27.25 27.55,27.6 27.25,27.9 27.25,29.75 v27.1,29.9
TIM2_CH2_BUZZER  (via drill 0.4)
  Top 0.254: STM32F103C8.11 17.2,25.55 17.45,25.8 17.45,31 16.85,31.6 v16.85,31.85 | v27.35,38.95 R4.2
  Bottom 0.254: v16.85,31.85 16.85,36.75 17.55,37.45 26.9,37.45 27.35,37.9 v27.35,38.95
TIM3_CH1
  Top 0.254: R3.1 22.2,33.9 22.15,33.85 22.15,33.35 21.75,32.8 STM32F103C8.40
USART1_RX  (via drill 0.4)
  Top 0.254: R10.2 9.25,11.7 8.35,12.6 v8.35,14.55 | v18.2,27.3 19.65,27.3 20.45,28.1 24.95,28.1 STM32F103C8.31
  Bottom 0.254: v8.35,14.55 8.35,15.45 6.2,17.6 6.2,26.2 6.85,26.85 17.3,26.85 17.75,27.3 v18.2,27.3
USART1_TX  (via drill 0.4)
  Top 0.254: R17.2 10.45,1.9 10.2,2.15 R2.2 9.25,3.6 8.9,3.95 T2.C 5.65,3.95 5.5,3.8 1.9,3.8 1.4,4.3 1.4,14.15 2.05,14.8 v3.45,14.8 | 23.5,27.6 24.95,27.6 STM32F103C8.30 25.8,27.55 26.5,28.25 v26.5,28.45 | v18.2,28.25 20,28.25 20.3,28.55 22.85,28.55 v23.55,29.25
  Bottom 0.254: v3.45,14.8 4.3,14.8 5.7,16.2 5.7,26.7 6.5,27.5 16.2,27.5 16.95,28.25 v18.2,28.25 | v23.55,29.25 26.4,29.25 26.65,29 26.65,28.6 v26.5,28.45
USART2_TX  (via drill 0.4)
  Top 0.254: R12.2 7.35,8.9 7.55,9.1 10.35,9.1 10.7,9.45 10.7,13.2 v11.05,13.55 | v14.95,25.15 15.35,25.15 15.45,25.05 STM32F103C8.12
  Bottom 0.254: v11.05,13.55 11.05,18.8 12.2,19.95 12.7,19.95 13.25,20.5 13.25,23.35 v14.95,25.15
USART3_RX
  Top 0.254: R16.1 25.45,11.7 24.2,12.95 22.85,12.95 22.15,13.65 22.15,16.6 22.6,17.05 23.55,17.05 24.15,17.8 24.15,19.3 24.6,19.75 24.6,21.3 24.05,21.95 22.8,21.95 22.25,22.55 STM32F103C8.22
USART3_TX
  Top 0.254: R21.1 24.6,11.75 23.85,12.5 22.6,12.5 21.65,13.45 21.65,16.85 22.35,17.5 23.25,17.5 23.7,18.05 23.7,19.55 24.1,19.95 24.1,21.15 23.8,21.5 22.6,21.5 21.75,22.4 STM32F103C8.21
VBAT_S  (via drill 0.4)
  Top 0.254: R1.1 32.25,24.05 31.75,23.55 30.85,23.55 30.4,23.1 30.4,22.2 R13.1 30.25,22.15 29.2,22.15 29.05,22 29.05,21.75 27.75,20.4 v27.75,20.1 | STM32F103C8.18 20.25,22.3 v20.45,22.1
  Bottom 0.254: v20.45,22.1 20.65,22.1 22.9,19.85 27.5,19.85 v27.75,20.1
VCC  (via drill 0.4)
  Top 0.254: 15,22.85 14.65,22.5 13.3,22.5 13.09,22.29 C15.1 | STM32F103C8.48 17.75,33.95 17.73,34.19 C4.2 17.2,34.85 16.8,35.25 16.45,35.65 16,36.1 16,38.2 16.75,38.95 22.05,38.95 22.68,39.69 R20.2 | STM32F103C8.1 15.3,30.55 15.05,30.8 15.05,32.15 15.06,32.01 C12.1 | C17.1 25.91,22.95 24.65,22.95 24.2,22.55 23.55,22.55 23.25,22.85 STM32F103C8.24 | FCM1608.1 7,18.71 7,19.45 7.2,19.65 9.7,19.65 10.53,19.68 13.18,19.68 | STM32F103C8.36 25.5,30.55 26,31.05 C18.1
  Top 0.61: 16.73,16.86 REG1117.4 16.76,15.12 REG1117.2 16.76,7.96 16.3,7.5 16.3,4.95 v16,4.65 | 13.15,19.65 13.18,19.68 13.1,19.75 13.1,21.29 C15.1 10.45,21.3 C7.1 | v12.85,2.1 12.85,3.45 12.5,3.8 R17.1 | SWD.1 34.25,9.76 34.25,11.1 35.45,12.3 36.25,12.3 R11.1 R7.1 | C17.1 26.21,23.25 27.4,23.25 28.05,23.9 28.05,26.15 29.05,27.15 | 29.05,27.15 35.1,27.15 35.85,26.4 35.85,16.4 36.45,15.8 R7.1 | 29.05,27.15 28.05,28.15 28.05,31.55 27.1,32.5 | C18.1 27.1,32.5 | 27.1,32.5 28,33.4 28,37.4 27.3,38.1 25.9,38.1 24.7,39.3 24.7,40.3 23.85,41.2 R20.2 | R9.1 15,23.79 15,22.85 | C12.1 16.45,32.7 16.8,33.05 16.8,34.45 17.2,34.85 | 36.5,15.15 R7.1
  Bottom 0.61: v16,4.65 13.3,1.95 13,1.95 v12.85,2.1 12.85,1.2 13.2,0.8 31.6,0.8 32.05,1.25 32.05,9.1 32.7,9.7 34.81,9.7 | I2C.3 37.62,4.63 36.75,5.5 36.75,9.4 36.45,9.7 34.81,9.7 | 34.81,9.7 SWD.1 34.25,9.76 34.25,10.75 33.8,11.2 32.85,11.2 32.55,11.5 32.55,14.25 33,14.7 C6.1 34,14.73 34,15.5 34.75,16.25 NRF24L01_SMD.P$8
  pour Top: 23.75,10.6 9.7,10.6 9.7,19.7 23.75,19.7
VI  (via drill 0.4, 0.6)
  Top 0.254: v34.85,25.75 34.85,23.15 33.95,22.25 R13.2 C20.1
  Top 0.61: U1.1 13.05,6.35 13.3,6.1 13.3,4.85 14.25,3.95 C10.1 14.25,1.25 | 14.25,1.25 14.7,0.8 27.35,0.8 27.75,1.2 27.75,4 28.4,4.6 29.62,4.6 USART.3 | R6.1 33.63,39.5 v32.7,39.5 | v19.05,41.8 8.05,41.8 4.95,38.7 4.95,16.65 3.95,15.65 1.85,15.65 0.7,14.6 0.7,1.8 1.7,0.75 13.65,0.75 14.15,1.25 14.25,1.25
  Bottom 0.254: v34.85,25.75 36.25,27.15 36.25,37.55 35.2,38.6 32.95,38.6 32.7,38.85 v32.7,39.5
  Bottom 0.61: BAT60J.C 7.2,5.05 7.55,4.7 10.2,4.7 10.95,5.45 10.95,5.9 11.4,6.35 U1.1 | v32.7,39.5 28.45,43.75 26.05,43.75 24.1,41.8 v19.05,41.8

### Text on the board
bPlace: AriloTX | (c) J.ARIGITA | 3.3V | SWCLK | GND | SWDIO | GND | V+ | 3.3V | PPM | 6V/TEL / (PIN4) | V+ | SCL | GND | TEL / (PIN1) | SDA | GND | 3.3V